# Altium schematic sheet Power_Control.SchDoc
size B
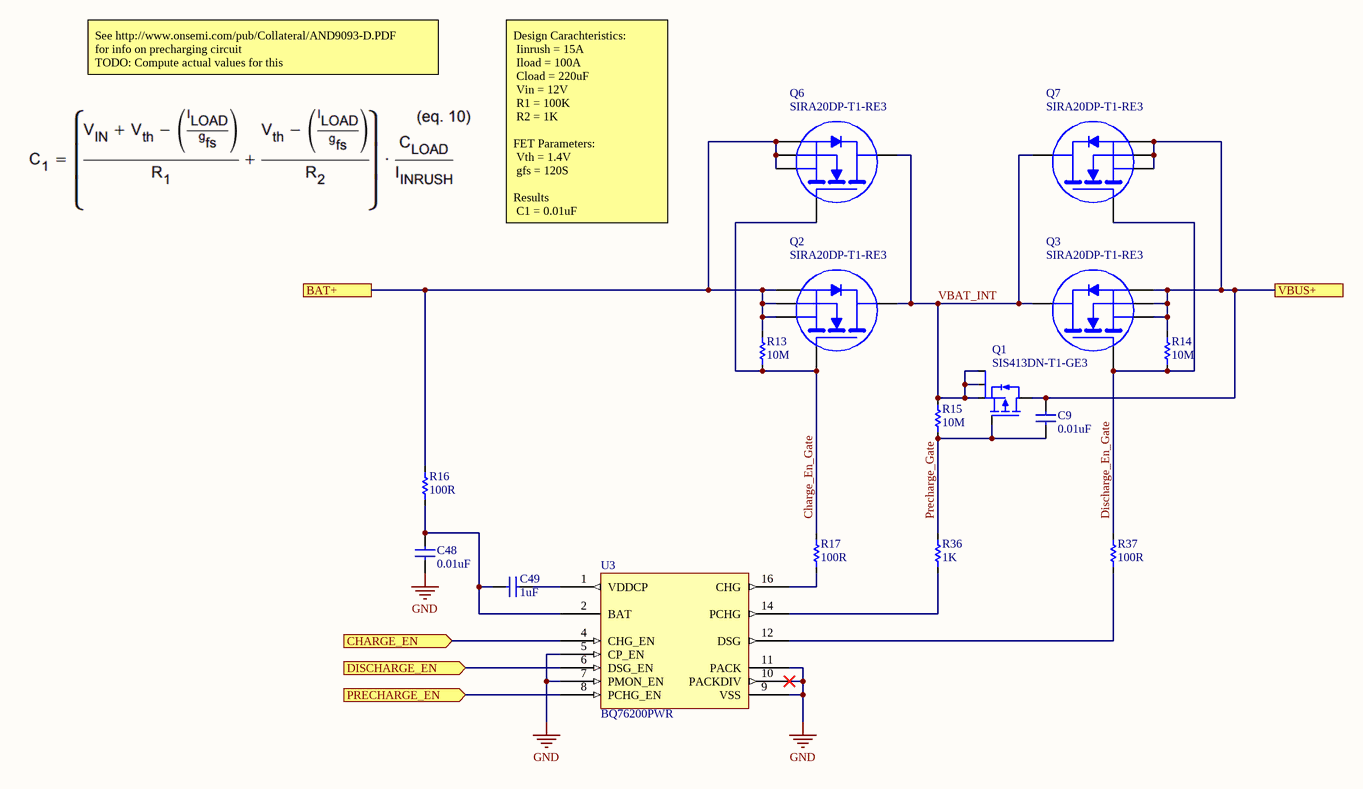
[diagram p0: Power_Control.SchDoc]

## Parts
C9  value 0.01uF  [0402_CAPACITOR]  (hidden comment: CAP 0.01uF 50V X7R)
C48  value 0.01uF  [0402_CAPACITOR]  (hidden comment: CAP 0.01uF 50V X7R)
C49  value 1uF  [1206_CAPACITOR]  (hidden comment: CAP 1uF 25V X7R)
Q1  SIS413DN-T1-GE3  [PowerPAK-1212-8]
Q2  SIRA20DP-T1-RE3  [PowerPAK-SO-8]
Q3  SIRA20DP-T1-RE3  [PowerPAK-SO-8]
Q6  SIRA20DP-T1-RE3  [PowerPAK-SO-8]
Q7  SIRA20DP-T1-RE3  [PowerPAK-SO-8]
R13  value 10M  [0402_Resistor]  (hidden comment: R_0402_10M_1%)
R14  value 10M  [0402_Resistor]  (hidden comment: R_0402_10M_1%)
R15  value 10M  [0402_Resistor]  (hidden comment: R_0402_10M_1%)
R16  value 100R  [0402_Resistor]  (hidden comment: R_0402_100R_1%)
R17  value 100R  [0402_Resistor]  (hidden comment: R_0402_100R_1%)
R36  value 1K  [0402_Resistor]  (hidden comment: R_0402_1K_1%)
R37  value 100R  [0402_Resistor]  (hidden comment: R_0402_100R_1%)
U3  BQ76200PWR  [TSSOP-16]

## Ports
BAT+, CHARGE_EN (in), DISCHARGE_EN (in), PRECHARGE_EN (in), VBUS+

## Nets
GND: C48.2 U3.5(CP_EN) U3.7(PMON_EN) U3.9(VSS) U3.10(PACKDIV) U3.11(PACK)
BAT+: Q2.1(SOURCE) Q2.2(SOURCE) Q2.3(SOURCE) Q6.1(SOURCE) Q6.2(SOURCE) Q6.3(SOURCE) R13.2 R16.2 ; port BAT+
CHARGE_EN: U3.4(CHG_EN) ; port CHARGE_EN
Charge_En_Gate: Q2.4(GATE) Q6.4(GATE) R13.1 R17.2
DISCHARGE_EN: U3.6(DSG_EN) ; port DISCHARGE_EN
Discharge_En_Gate: Q3.4(GATE) Q7.4(GATE) R14.1 R37.2
PRECHARGE_EN: U3.8(PCHG_EN) ; port PRECHARGE_EN
Precharge_Gate: C9.2 Q1.4(GATE) R15.1 R36.2
VBAT_INT: Q1.1(SOURCE) Q1.2(SOURCE) Q1.3(SOURCE) Q2.5(DRAIN) Q3.5(DRAIN) Q6.5(DRAIN) Q7.5(DRAIN) R15.2
VBUS+: C9.1 Q1.5(DRAIN) Q3.1(SOURCE) Q3.2(SOURCE) Q3.3(SOURCE) Q7.1(SOURCE) Q7.2(SOURCE) Q7.3(SOURCE) R14.2 ; port VBUS+
NetC48_1: C48.1 C49.1 R16.1 U3.2(BAT)
NetC49_2: C49.2 U3.1(VDDCP)
NetR17_1: R17.1 U3.16(CHG)
NetR36_1: R36.1 U3.14(PCHG)
NetR37_1: R37.1 U3.12(DSG)

## Notes on the sheet
- See http://www.onsemi.com/pub/Collateral/AND9093-D.PDF
  for info on precharging circuit
  TODO: Compute actual values for this
- Design Carachteristics:
  Iinrush = 15A
  Iload = 100A
  Cload = 220uF
  Vin = 12V
  R1 = 100K
  R2 = 1K
  FET Parameters:
  Vth = 1.4V
  gfs = 120S
  Results
  C1 = 0.01uF

## Library data of the parts
C9 C48 = C_0402_0.01uF_50V_10%: CAP CERM 0.01uF 10% 50V 0402; Package: =SelectedPackage; Voltage: 50V; Temperature Coefficient: X7R; Supplier 1: Digi-Key; Supplier Part Number 1: 1276-1028-1-ND
C49 = C_1206_1uF_25V_20%: CAP CERM 1uF 20% 25V 1206; SVP Creator: Spencer Berglund; Package: =SelectedPackage; Voltage: 25V; Temperature Coefficient: X7R; Supplier 1: Digi-Key; Supplier Part Number 1: 1276-3098-1-ND
Q1 = Q_SIS413DN-T1-GE3: P-Channel 30V 18A (Tc) 3.7W (Ta), 52W (Tc) Surface Mount PowerPAK® 1212-8; Manufacturer: Vishay Siliconix; Continuous Drain Current (ID): -18A; Drain to Source Breakdown Voltage: -30V; Drain to Source Resistance: 9.4mR; Fall Time: 8ns; Gate to Source Voltage (Vgs): 20V; Input Capacitance: 4.28nF; Rise Time: 11ns; Threshold Voltage: -2.5V; Turn-Off Delay Time: 45ns; ComponentLink1URL: http://www.st.com/web/en/resource/technical/document/datasheet/CD00001894.pdf; ComponentLink1Description: http://www.st.com/web/en/resource/technical/document/datasheet/CD00001894.pdf; Manufacturer Part Number: SIS413DN-T1-GE3; Supplier 1: Digi-Key; Supplier 2: Mouser; Supplier Part Number 1: SIS413DN-T1-GE3CT-ND; Supplier Part Number 2: 78-SIS413DN-T1-GE3; Drain to Source Voltage (Vdss): -30V; Max Operating Temperature: 150°C; Max Power Dissipation: 52W; Min Operating Temperature: -55°C
Q2 Q3 Q6 Q7 = Q_SIRA20DP-T1-RE3: N-Channel 25V 81.7A (Ta), 100A (Tc) 6.25W (Ta), 104W (Tc) Surface Mount PowerPAK® SO-8; Manufacturer: Vishay; Drive Voltage (Max Rds On, Min Rds On): 4.5V, 10V; Rds On (Max) @ Id, Vgs: 0.58mOhm @ 20A, 10V; Vgs(th) (Max) @ Id: 2.1V @ 250µA; Vgs (Max): +16V, -12V; Input Capacitance (Ciss) (Max) @ Vds: 10850pF @ 10V; Gate Charge (Qg) (Max) @ Vgs: 200nC @ 10V; Supplier 1: Digi-Key; Supplier 2: Mouser; Supplier Part Number 1: SIRA20DP-T1-RE3CT-ND; Supplier Part Number 2: 78-SIRA20DP-T1-RE3; Manufacturer Part Number: SIRA20DP-T1-RE3; Drain to Source Voltage (Vdss): 25V; Current - Continuous Drain (Id) @ 25°C: 81.7A (Ta), 100A (Tc); Power Dissipation (Max): 6.25W (Ta), 104W (Tc); Operating Temperature: -55°C ~ 150°C (TJ)
R13-R17 R36 R37 = R_0402_generic_1%: Generic 0402 Resistor (10.2R to 10M); Manufacturer: Yageo; Power Rating: 0.0625W; Temperature Coefficient: ±100ppm/°C; Tolerance: ±1%; Voltage Rating: 50V; Operating Temperature: -55°C ~ 155°C; Manufacturer Part Number: ='RC0402FR-07'+ValueFormatted+'L'; HelpURL: https://www.digikey.com/products/en/resistors/chip-resistor-surface-mount/52?pv17=103&FV=fffc000d%2Cc0001%2C1c0002%2C1f140000%2Cffe00034&k=RC0402; ValueFormatted: =Copy(Copy(Value, 0, Pos('.', Value)-1)+Copy(Value, Length(Value), 1)+Copy(Value, Pos('.', Value)+1, Length(Value)-Pos('.', Value)-1),1,Pos('.',Value)*Length(Value))+Copy(Value,1,Length(Value)*(1-Pos('.',Value)))
U3 = U_BQ76200PWR: Battery Battery Protection IC Lead Acid 16-TSSOP; Supplier 1: Digi-Key; Supplier 2: Mouser; Supplier Part Number 1: 296-43273-1-ND; Supplier Part Number 2: 595-BQ76200PWR